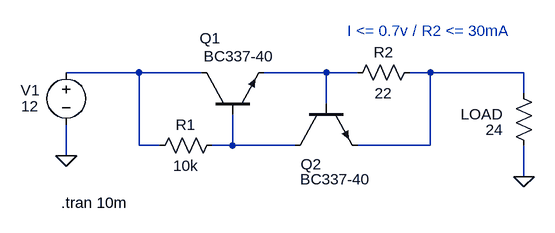
[diagram p0: schematic v1.1.asc]
v1.1.asc, the LTspice schematic file:
Version 4.1
SHEET 1 880 680
WIRE 112 128 0 128
WIRE 208 128 112 128
WIRE 400 128 304 128
WIRE 448 128 400 128
WIRE 560 128 528 128
WIRE 704 128 560 128
WIRE 704 160 704 128
WIRE 400 176 400 128
WIRE 112 240 112 128
WIRE 144 240 112 240
WIRE 256 240 256 192
WIRE 256 240 224 240
WIRE 352 240 256 240
WIRE 560 240 560 128
WIRE 560 240 448 240
WIRE 0 256 0 208
WIRE 704 288 704 240
FLAG 0 256 0
FLAG 704 288 0
SYMBOL voltage 0 112 R0
WINDOW 0 -70 43 Left 2
WINDOW 3 -69 68 Left 2
WINDOW 123 0 0 Left 0
WINDOW 39 0 0 Left 0
SYMATTR InstName V1
SYMATTR Value 12
SYMBOL res 240 224 R90
WINDOW 0 0 56 VBottom 2
WINDOW 3 32 56 VTop 2
SYMATTR InstName R1
SYMATTR Value 10k
SYMBOL npn 352 176 M90
WINDOW 0 93 9 VRight 2
WINDOW 3 116 8 VRight 2
SYMATTR InstName Q2
SYMATTR Value BC337-40
SYMBOL res 544 112 R90
WINDOW 0 0 56 VBottom 2
WINDOW 3 32 56 VTop 2
SYMATTR InstName R2
SYMATTR Value 22
SYMBOL res 720 256 R180
WINDOW 0 48 64 Left 2
WINDOW 3 48 40 Left 2
SYMATTR InstName LOAD
SYMATTR Value 24
SYMBOL npn 208 192 R270
WINDOW 0 117 -3 VRight 2
WINDOW 3 89 112 VLeft 2
SYMATTR InstName Q1
SYMATTR Value BC337-40
TEXT -8 328 Left 2 !.tran 10m
TEXT 432 64 Left 2 ;I <= 0.7v / R2 <= 30mA

The netlist it stands for:
* v1.1.asc
V1 N001 0 12
R1 N004 N001 10k
Q2 N004 N002 N003 0 BC337-40
R2 N003 N002 22
R§LOAD 0 N003 24
Q1 N001 N004 N002 0 BC337-40
.model NPN NPN
.model PNP PNP
.lib standard.bjt
.tran 10m
* I <= 0.7v / R2 <= 30mA
.backanno
.end